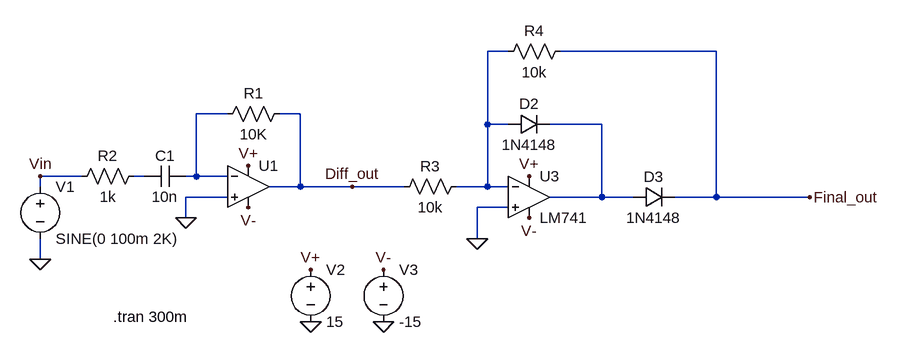
[diagram p0: schematic Final_Circuit.asc]
Final_Circuit.asc, the LTspice schematic file:
Version 4
SHEET 1 1828 680
WIRE 576 -64 544 -64
WIRE 896 -64 656 -64
WIRE 144 32 96 32
WIRE 256 32 224 32
WIRE 544 48 544 -64
WIRE 576 48 544 48
WIRE 720 48 640 48
WIRE -80 128 -144 128
WIRE 16 128 0 128
WIRE 96 128 96 32
WIRE 96 128 80 128
WIRE 144 128 96 128
WIRE -144 144 -144 128
WIRE 256 144 256 32
WIRE 256 144 208 144
WIRE 336 144 256 144
WIRE 416 144 336 144
WIRE 544 144 544 48
WIRE 544 144 496 144
WIRE 576 144 544 144
WIRE 144 160 80 160
WIRE 720 160 720 48
WIRE 720 160 640 160
WIRE 768 160 720 160
WIRE 896 160 896 -64
WIRE 896 160 832 160
WIRE 1040 160 896 160
WIRE 576 176 528 176
WIRE 80 192 80 160
WIRE 528 224 528 176
WIRE -144 256 -144 224
FLAG 80 192 0
FLAG -144 256 0
FLAG 176 112 V+
FLAG 176 176 V-
FLAG 272 272 V+
FLAG 384 272 V-
FLAG 272 352 0
FLAG 384 352 0
FLAG 528 224 0
FLAG 608 128 V+
FLAG 608 192 V-
FLAG -144 128 Vin
FLAG 336 144 Diff_out
FLAG 1040 160 Final_out
SYMBOL res 240 16 R90
WINDOW 0 0 56 VBottom 2
WINDOW 3 32 56 VTop 2
SYMATTR InstName R1
SYMATTR Value 10K
SYMBOL voltage -144 128 R0
WINDOW 123 24 124 Left 2
WINDOW 39 0 0 Left 0
SYMATTR InstName V1
SYMATTR Value SINE(0 100m 2K)
SYMBOL cap 80 112 R90
WINDOW 0 0 32 VBottom 2
WINDOW 3 32 32 VTop 2
SYMATTR InstName C1
SYMATTR Value 10n
SYMBOL OpAmps\\UniversalOpAmp2 176 144 R0
SYMATTR InstName U1
SYMBOL voltage 272 256 R0
WINDOW 123 0 0 Left 0
WINDOW 39 0 0 Left 0
SYMATTR InstName V2
SYMATTR Value 15
SYMBOL voltage 384 256 R0
WINDOW 123 0 0 Left 0
WINDOW 39 0 0 Left 0
SYMATTR InstName V3
SYMATTR Value -15
SYMBOL res 16 112 R90
WINDOW 0 0 56 VBottom 2
WINDOW 3 32 56 VTop 2
SYMATTR InstName R2
SYMATTR Value 1k
SYMBOL res 512 128 R90
WINDOW 0 0 56 VBottom 2
WINDOW 3 32 56 VTop 2
SYMATTR InstName R3
SYMATTR Value 10k
SYMBOL OpAmps\\LM741 608 96 R0
SYMATTR InstName U3
SYMBOL diode 576 64 R270
WINDOW 0 32 32 VTop 2
WINDOW 3 0 32 VBottom 2
SYMATTR InstName D2
SYMATTR Value 1N4148
SYMBOL diode 768 176 R270
WINDOW 0 32 32 VTop 2
WINDOW 3 0 32 VBottom 2
SYMATTR InstName D3
SYMATTR Value 1N4148
SYMBOL res 672 -80 R90
WINDOW 0 0 56 VBottom 2
WINDOW 3 32 56 VTop 2
SYMATTR InstName R4
SYMATTR Value 10k
TEXT -32 344 Left 2 !.tran 300m

The netlist it stands for:
* Final_Circuit.asc
R1 Diff_out N002 10K
V1 Vin 0 SINE(0 100m 2K)
C1 N002 N004 10n
XU1 0 N002 V+ V- Diff_out level2 Avol=1Meg GBW=10Meg Slew=10Meg Ilimit=25m Rail=0 Vos=0 En=0 Enk=0 In=0 Ink=0 Rin=500Meg  ; pins In+ In- V+ V- OUT
V2 V+ 0 15
V3 V- 0 -15
R2 N004 Vin 1k
R3 N001 Diff_out 10k
XU3 0 N001 V+ V- N003 LM741  ; pins In+ In- V+ V- OUT
D2 N001 N003 1N4148
D3 N003 Final_out 1N4148
R4 Final_out N001 10k
.model D D
.lib standard.dio
.tran 300m
.lib UniversalOpAmp2.lib
.lib LM741.lib
.backanno
.end